# EAGLE design Arduino 1.0 (EAGLE 9.6.2)
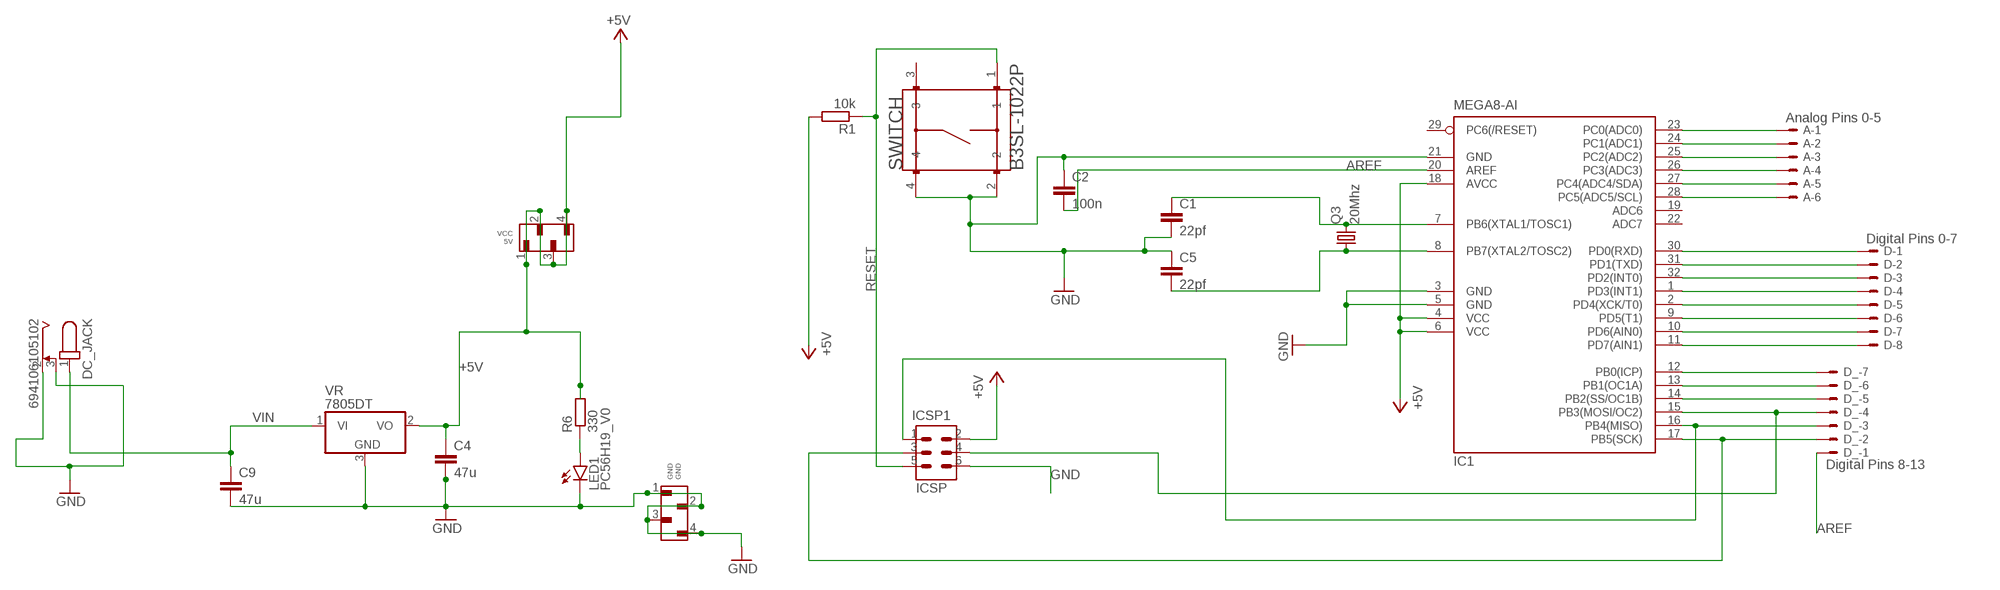
[diagram p0: schematic, sheet 1]

## Parts
A  Analog Pins 0-5  87438-06  [87438-06]
C1  22pf  C-EUC0805  [C0805]
C2  100n  C-EUC0805  [C0805]
C4  47u  C-EUC0805  [C0805]
C5  22pf  C-EUC0805  [C0805]
C9  47u  C-EUC0805  [C0805]
D  Digital Pins 0-7  87438-08  [87438-08]
D_  Digital Pins 8-13  87438-07  [87438-07]
DC_JACK  694106105102  [694106105102]
GND  GND  6100XX18221_61000418221  [61000418221]
IC1  MEGA8-AI  [TQFP32-08]
ICSP1  ICSP  621006245821  [621006245821]
LED1  PC56H19_V0  [PC56H19_V0]
Q3  20Mhz  FC-12M  [FC-12M]
R1  10k  R-EU_M0805  [M0805]
R6  330  R-EU_M0805  [M0805]
SWITCH  B3SL-1022P  [SW_B3SL-1022P]
VCC  5V  6100XX18221_61000418221  [61000418221]
VR  7805DT  [TO252]

## Nets
+5V [power]: C4.1 IC1.4(VCC) IC1.6(VCC) IC1.18(AVCC) ICSP1.2 R1.2 R6.2 VCC.1 VCC.2 VCC.3 VCC.4 VR.2(VO)
AREF [power]: C2.2 D_.1 IC1.20(AREF)
GND [power]: C1.2 C2.1 C4.2 C5.1 C9.2 DC_JACK.2 DC_JACK.3 GND.1 GND.2 GND.3 GND.4 IC1.3(GND) IC1.5(GND) IC1.21(GND) ICSP1.6 LED1.1(C) LED1.3(C) SWITCH.2 SWITCH.4 VR.3(GND)
N$1 [power]: C1.1 IC1.7(PB6(XTAL1/TOSC1)) Q3.2
N$2: D_.2 IC1.17(PB5(SCK)) ICSP1.3
N$3: LED1.2(A) LED1.4(A) R6.1
N$4: D_.3 IC1.16(PB4(MISO)) ICSP1.1
N$5 [power]: C5.2 IC1.8(PB7(XTAL2/TOSC2)) Q3.1
N$6: D_.5 IC1.14(PB2(SS/OC1B))
N$7: D_.6 IC1.13(PB1(OC1A))
N$8: D_.7 IC1.12(PB0(ICP))
N$9: D.1 IC1.30(PD0(RXD))
N$10: D.2 IC1.31(PD1(TXD))
N$11: D.3 IC1.32(PD2(INT0))
N$12: D.4 IC1.1(PD3(INT1))
N$13: D.5 IC1.2(PD4(XCK/T0))
N$14: D.6 IC1.9(PD5(T1))
N$15: D.7 IC1.10(PD6(AIN0))
N$16: D.8 IC1.11(PD7(AIN1))
N$17: A.1 IC1.23(PC0(ADC0))
N$18: A.2 IC1.24(PC1(ADC1))
N$19: A.3 IC1.25(PC2(ADC2))
N$20: A.4 IC1.26(PC3(ADC3))
N$21: A.5 IC1.27(PC4(ADC4/SDA))
N$22: A.6 IC1.28(PC5(ADC5/SCL))
N$29: D_.4 IC1.15(PB3(MOSI/OC2)) ICSP1.4
RESET: ICSP1.5 R1.1 SWITCH.1
VIN [power]: C9.1 DC_JACK.1 VR.1(VI)
Unconnected: IC1.19(ADC6) IC1.22(ADC7) IC1.29(PC6(/RESET)) SWITCH.3

## Library data of the parts
A = con-molex:87438-06: Wire-to-Board 1.50mm (.059") Pitch Header - Right Angle, SMT, Shrouded Source: http://www.molex.com/product/micro/87438.html; MF: MOLEX; MPN: 87438-0643; OC_FARNELL: 1756938; OC_NEWARK: 88K3155
C1 C2 C4 C5 C9 = rcl:C-EU: CAPACITOR, European symbol; SPICEPREFIX: C
D = con-molex:87438-08: Wire-to-Board 1.50mm (.059") Pitch Header - Right Angle, SMT, Shrouded Source: http://www.molex.com/product/micro/87438.html; MF: MOLEX; OC_FARNELL: 1756939; OC_NEWARK: unknown
D_ = con-molex:87438-07: Wire-to-Board 1.50mm (.059") Pitch Header - Right Angle, SMT, Shrouded Source: http://www.molex.com/product/micro/87438.html; MF: WALDOM/MOLEX; MPN: 87438-0733; OC_FARNELL: unknown; OC_NEWARK: 09J7507
DC_JACK = DC Power Jacks:694106105102: CONN PWR JACK 2.05X5.5MM SOLDER Manufacturer's datasheet <https://katalog.we-online.de/em/datasheet/6941xx105102.pdf>; CREATED_BY: PCBLayout.com; DIGIKEY_PART_NUMBER: 732-5928-2-ND; MANUFACTURER: Wurth Electronics Inc.; MPN: 694106105102
GND VCC = Wurth_Connectors_WR-PHD:6100XX18221_61000418221: WR-PHD 2.54 mm SMT Pin Header ARTICLE PROPERTIES: Pins:4;​ 6;​ 10;​ 14;​ 16;​ 24;​ 32;​ 34;​ 36 KIND PROPERTIES: Pitch：2.54 mm Quality Class:3 as per CECC 75 301-802 Rows：Single Gender：Pin Header Type：Straight Type 1;​ Straight Type 2 MATERIAL PROPERTIES: Insulator Material :PA6T Insulator Flammability Rating:UL94 V-0 Contact Material:Copper Alloy Contact Plating:Gold Contact Type:Stamped GENERAL INFORMATION Operating Temperature:-40 up to +125 °C Compliance:Lead free / RoHS ELECTRICAL PROPERTIES: Rated Current:3 A IR 1:3 A Withstanding Voltage:500 V (AC) Contact Resistance:20 mΩ RISO:1000 MΩ CERTIFICATION UL Approval:E323964 PACKAGING PROPERTIES Packaging:Tube <https://katalog.we-online.com/media/images/v2/o33202v209%20Family_WR-PHD_6100xx18221.jpg> Details see: https://katalog.we-online.com/en/em/PHD_2_54_SMT_PIN_HEADER_6100XX18X21 Updated by Yingchun,Shan 2019-10-18 2019 (C) Würth Elektronik; DATASHEET-URL: https://katalog.we-online.com/em/datasheet/61000418221.pdf; GENDER: Pin Header; IR: 3A; MATES: WR-PHD 2.54mm Angled Socket Header/SMT Socket Header/Socket Header/Socket Header Bottom Entry; PACKAGING: Tube; PART-NUMBER: 61000418221; PINS: 4; ROWS: Single; TYPE: Straight Type 1
IC1 = atmel:MEGA8: MICROCONTROLLER 8 Kbytes FLASH, 1 kbytes SRAM, 512 bytes EEPROM, USART, 6-channel 10 bit ADC, 2-channel 8 bit ADC Pin compatible with Atmega48, ATMega88, ATMega168 Source: avr.lbr; MPN: ATMEGA8-16AU; OC_FARNELL: 9171371; OC_NEWARK: 73M8863
ICSP1 = Headers:621006245821: 2.00mm SMT Straight Dual Low Profile Pin Header WR-PHD Manufacturer's datasheet <https://katalog.we-online.com/em/datasheet/621006245821.pdf>; CREATED_BY: PCBLayout.com; MANUFACTURER: Wurth Elektronik; MPN: 621006245821
LED1 = led:PC56H19_V0: Lextar white SMD LED Source: PC56H19_20150317.pdf www.lextar.com
Q3 = crystal:FC-12M: kHz RANGE CRYSTAL UNIT LOW PROFILE SMD Source: Epson Toyocom FC-12M.pdf
R1 R6 = rcl:R-EU_: RESISTOR, European symbol; SPICEPREFIX: R
SWITCH = B3SL-1022P:B3SL-1022P: Surface-mounting Switches with a Sealed Structure (Rubber Plunger), Crisp Feel, and Middle Stroke. Check prices <https://pricing.snapeda.com/parts/B3SL-1022P/Omron/view-part?ref=eda>; AVAILABILITY: In Stock; DESCRIPTION: Tactile Switch SPST-NO Top Actuated Surface Mount; MF: Omron; MP: B3SL-1022P; PACKAGE: None; PRICE: None; PURCHASE-URL: https://pricing.snapeda.com/search/part/B3SL-1022P/?ref=eda
VR = linear:78*: Positive VOLTAGE REGULATOR Source: http://cache.national.com/ds/LM/LM78L05.pdf http://www.fairchildsemi.com/ds/LM/LM7805.pdf

## Net classes
0 default: width 0.203 mm, clearance 0.203 mm
1 power: width 0.6 mm, clearance 0.305 mm

## Board
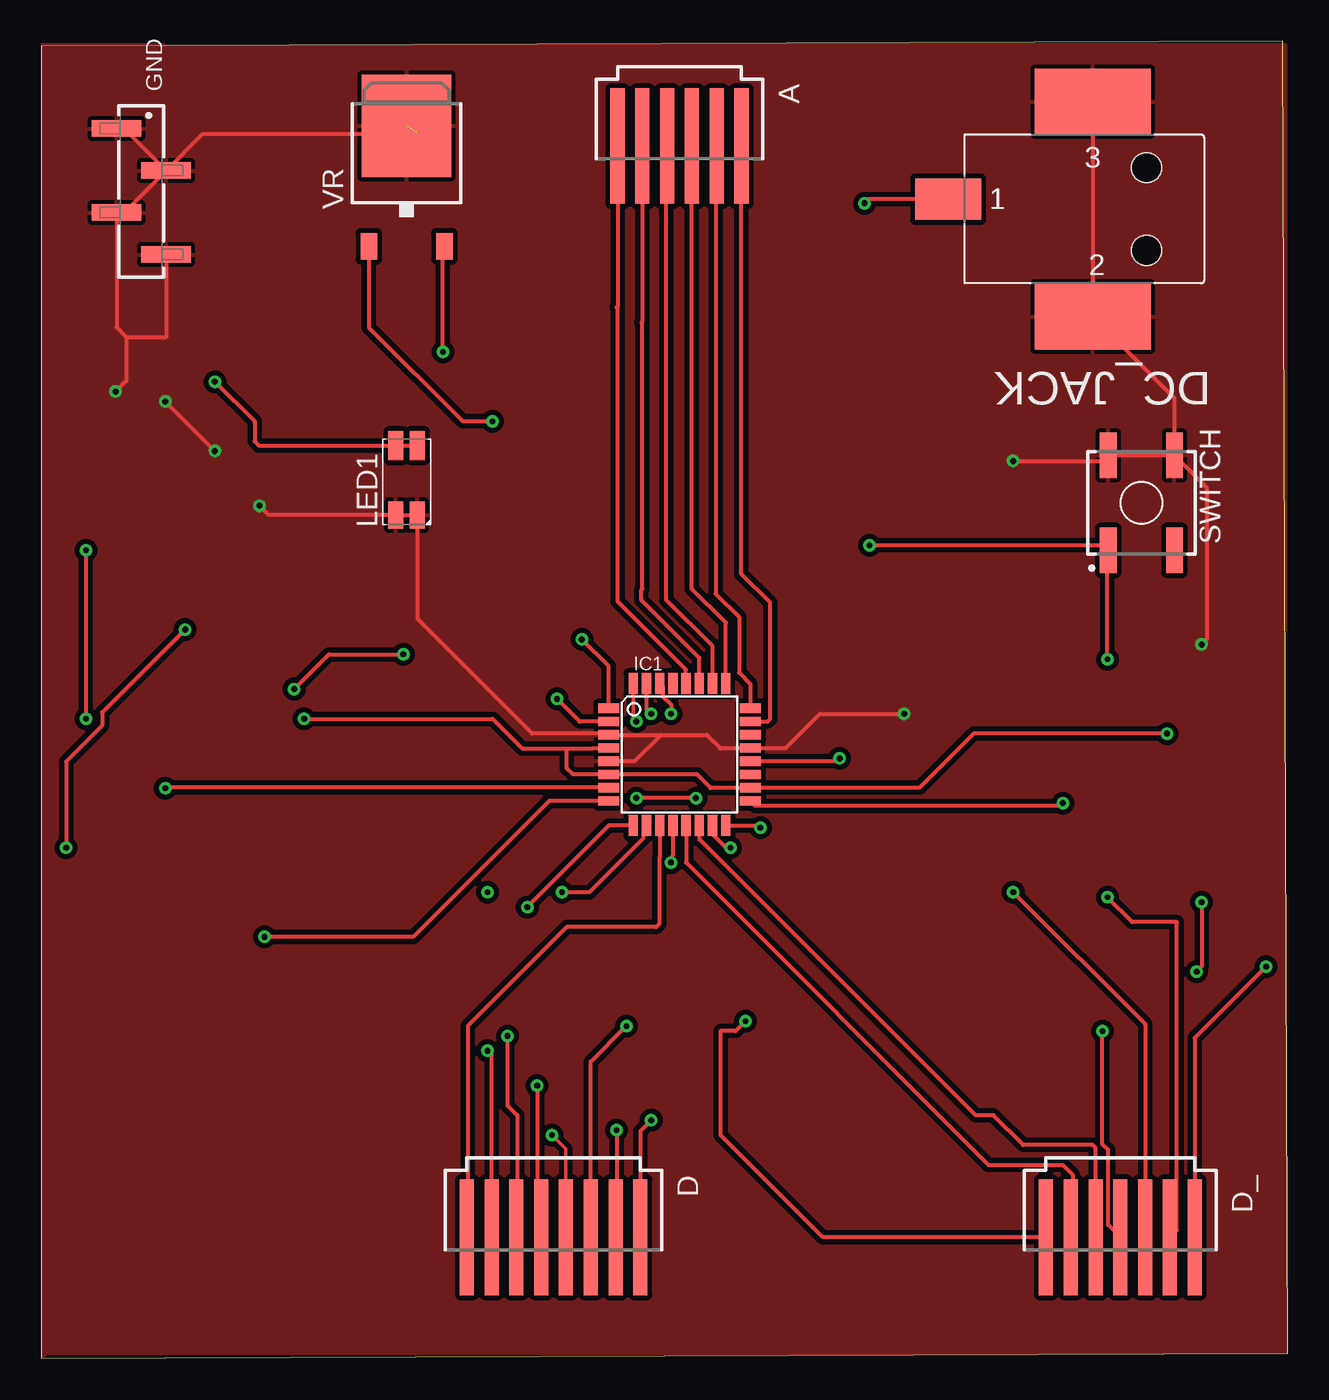
[diagram p1: board, top side]
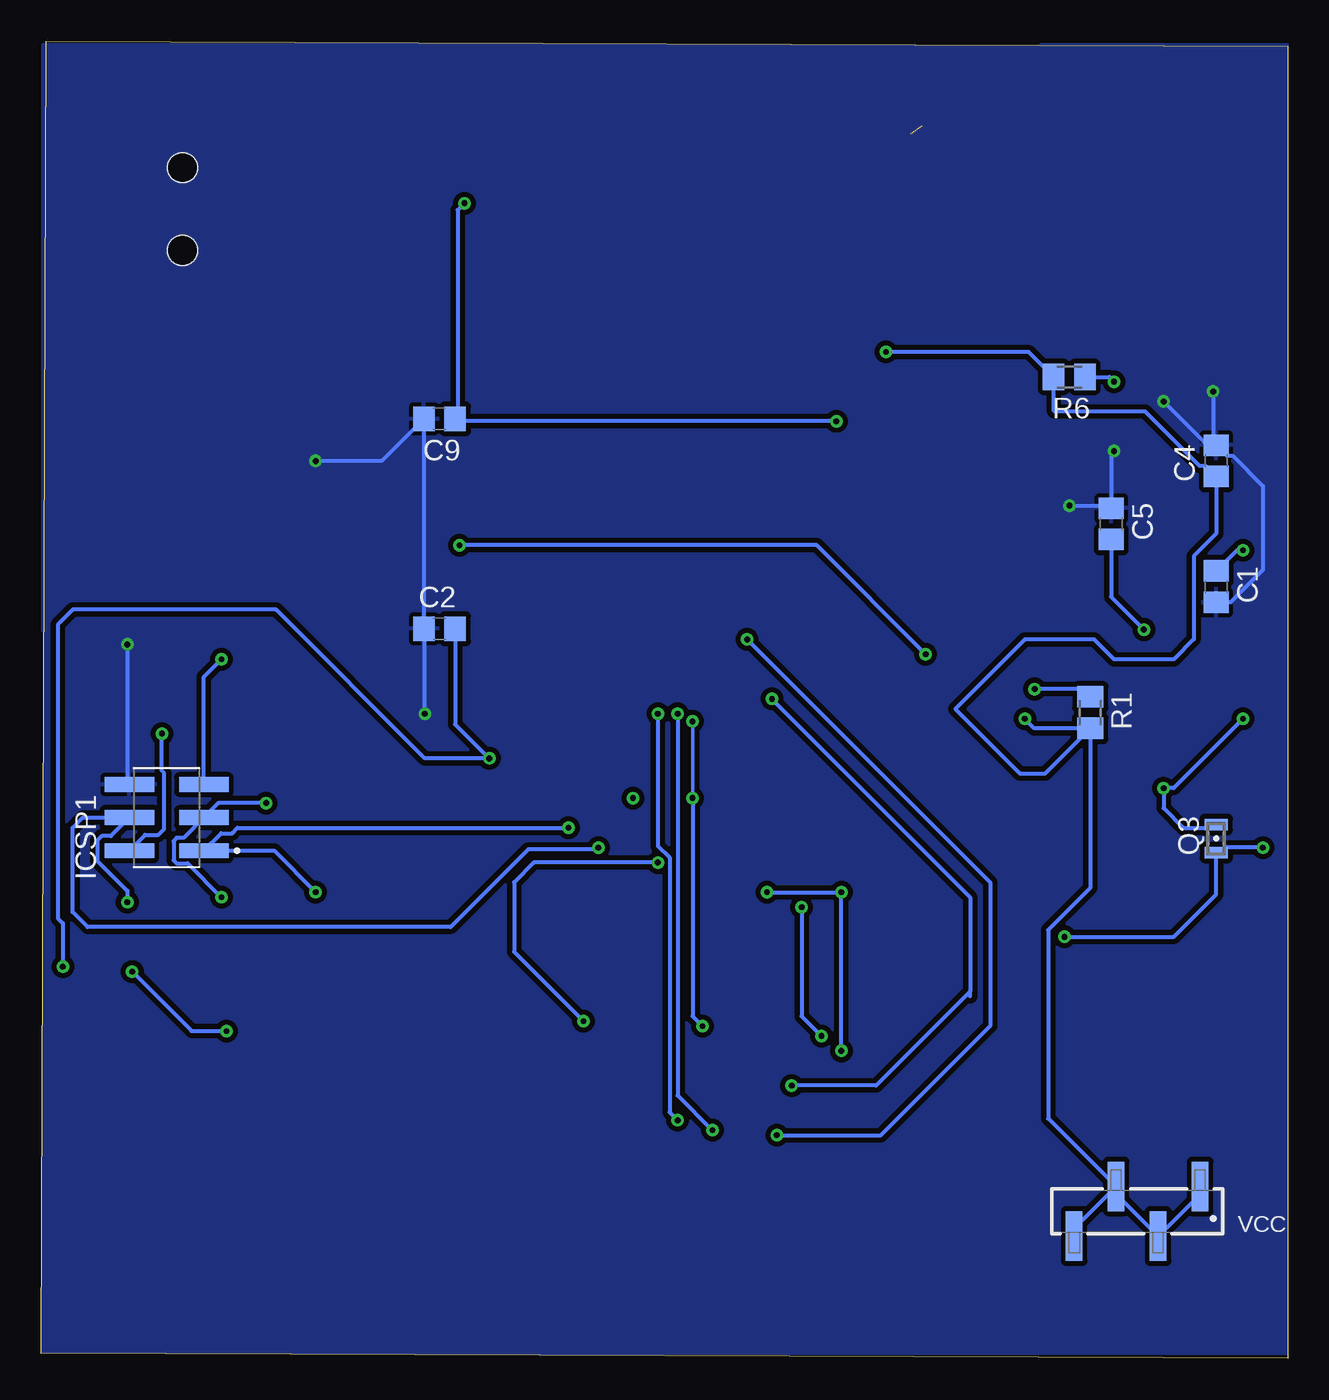
[diagram p2: board, bottom side, seen from below]

Size 75.4 x 79.7 mm. Coordinates in mm from the lower left corner, seen from the top.
Outline: 0,0 75.4,0.3 75.1,79.7 0,79.4 0,0
Copper layers (1*16): Top 0.035mm / dielectric 1.5mm / Bottom 0.035mm
Design rules "default *": minimum track width 1mil, minimum drill 0.35mm, track to track 1mil, track to pad 1mil, pad to pad 1mil, via to via 1mil, smd to smd 1mil, copper to edge 1mil, drill to drill 1mil, minimum pad ring 10mil, minimum via ring 8mil, stop-mask expansion 4mil, vias tented up to drill 0mil, thermal gap 10mil

### Footprints (pad centres in the part's own frame; a part is rotated, then mirrored left to right if it is on the bottom)
87438-06 = smd 7 x 0.85: 1 0,3.75; 2 0,2.25; 3 0,0.75; 4 0,-0.75; 5 0,-2.25; 6 0,-3.75
C0805 = smd 1.3 x 1.5: 1 -0.95,0; 2 0.95,0
87438-08 = smd 7 x 0.85: 1 0,5.25; 2 0,3.75; 3 0,2.25; 4 0,0.75; 5 0,-0.75; 6 0,-2.25; 7 0,-3.75; 8 0,-5.25
87438-07 = smd 7 x 0.85: 1 0,4.5; 2 0,3; 3 0,1.5; 4 0,0; 5 0,-1.5; 6 0,-3; 7 0,-4.5
694106105102 = smd 4 x 2.5: 1 15.5,-0.6 | smd 7 x 4: 2 6.75,6.5; 3 6.75,-6.5 | hole 1.8: 3.5,2.5; 3.5,-2.5
61000418221 = smd 1 x 3: 1 -3.81,-1.5; 2 -1.27,1.5; 3 1.27,-1.5; 4 3.81,1.5
TQFP32-08 = smd 1.27 x 0.559: 1 -4.293,2.8; 2 -4.293,2; 3 -4.293,1.2; 4 -4.293,0.4; 5 -4.293,-0.4; 6 -4.293,-1.2; 7 -4.293,-2; 8 -4.293,-2.8; 17 4.293,-2.8; 18 4.293,-2; 19 4.293,-1.2; 20 4.293,-0.4; 21 4.293,0.4; 22 4.293,1.2; 23 4.293,2; 24 4.293,2.8 | smd 0.559 x 1.27: 9 -2.8,-4.293; 10 -2,-4.293; 11 -1.2,-4.293; 12 -0.4,-4.293; 13 0.4,-4.293; 14 1.2,-4.293; 15 2,-4.293; 16 2.8,-4.293; 25 2.8,4.293; 26 2,4.293; 27 1.2,4.293; 28 0.4,4.293; 29 -0.4,4.293; 30 -1.2,4.293; 31 -2,4.293; 32 -2.8,4.293
621006245821 = smd 0.89 x 3: 1 -2,-2.25; 2 -2,2.25; 3 0,-2.25; 4 0,2.25; 5 2,-2.25; 6 2,2.25
PC56H19_V0 = smd 1.63 x 0.9: 1 -2.01,0.65; 3 -2.01,-0.645 | smd 1.73 x 0.9: 2 2.195,0.65; 4 2.195,-0.65
FC-12M = smd 0.7 x 1.4: 1 -0.85,0; 2 0.85,0
M0805 = smd 1.3 x 1.6: 1 -0.95,0; 2 0.95,0
SW_B3SL-1022P = smd 2.75 x 1: 1 2.875,-2; 2 -2.875,-2; 3 2.875,2; 4 -2.875,2
TO252 = smd 1 x 1.6: 1 -2.28,-4.8; 2 2.28,-4.8 | smd 5.4 x 6.2: 3 0,2.5

### Placement (x,y rotation side)
A  38.61,73.36 270 top
C1  4.32,46.69 270 bottom
C2  51.31,44.15 0 bottom
C4  4.32,54.31 90 bottom
C5  10.67,50.5 270 bottom
C9  51.31,56.85 180 bottom
D  30.99,7.32 270 top
D_  65.28,7.32 270 top
DC_JACK  70.36,69.55 180 top
GND  6.05,70.61 270 top
IC1  38.61,36.53 0 top
ICSP1  67.82,32.72 90 bottom
LED1  22.1,53.04 90 top
Q3  4.32,31.45 90 bottom
R1  11.94,39.07 270 bottom
R6  13.21,59.39 180 bottom
SWITCH  66.55,51.77 270 top
VCC  9.1,8.89 180 bottom
VR  22.1,72.09 0 top

### Tracks (layer width: path | path; a pad name or v marks a point on that pad's centre or on a via)
+5V  (via drill 0.35)
  Top 0.254: v15.9,38.7 27.3,38.7 29.1,36.9 31.8,36.9 | 31.8,36.9 33.32,36.9 | 33.32,36.9 33.35,36.93 | IC1.4 34.29,36.9 33.32,36.9 | v24.3,60.9 24.3,67.21 VR.2 | 31.8,36.9 31.8,35.7 32.17,35.33 IC1.6 39.67,35.33 40.5,34.5 42.87,34.5 IC1.18 53.13,34.53 56.4,37.8 v68.1,37.8
  Bottom 0.254: R1.2 11.94,28.45 14.48,25.91 14.48,14.5 VCC.3 | VCC.1 5.29,9.93 VCC.2 10.37,9.93 VCC.3 | VCC.3 12.91,7.85 VCC.4 | R1.2 14.66,35.4 16.2,35.4 20.1,39.3 15.9,43.5 11.7,43.5 10.5,42.3 6.9,42.3 5.67,43.52 5.67,48.54 4.32,49.9 C4.1 4.96,54.01 5.32,54.01 8.62,57.3 14.1,57.3 14.16,57.36 R6.2 15.67,60.9 v24.3,60.9 | R1.2 15.32,38.12 v15.9,38.7 | ICSP1.2 69.12,31.67 68.32,31.67 67.97,32.02 67.97,35.42 68.1,35.55 v68.1,37.8
AREF  (via drill 0.35)
  Top 0.254: IC1.20 48.13,36.13 v48.3,36.3 | v74.1,23.7 69.78,19.38 D_.1
  Bottom 0.254: C2.2 50.36,38.36 v48.3,36.3 52.2,36.3 61.2,45.3 73.5,45.3 74.41,44.4 74.41,26.62 74.1,26.32 v74.1,23.7
GND  (via drill 0.35)  (1 unrouted)
  Top 0.254: 37.5,37.73 IC1.3 34.24,37.8 29.7,37.8 22.75,44.76 LED1.3 LED1.1 13.77,51.03 v13.2,51.6 | 37.5,37.73 40.27,37.73 41.1,36.9 42.87,36.9 IC1.21 45.03,36.93 47.1,39 v52.2,39 | IC1.5 35.9,36.13 37.5,37.73 | GND.4 7.55,61.8 5.15,61.8 | 5.15,61.8 5.15,59.15 v4.5,58.5 | v7.5,57.9 v10.5,54.9 | v58.8,54.3 64.2,54.3 SWITCH.2 SWITCH.4 | DC_JACK.3 DC_JACK.2 68.55,58.11 SWITCH.4 | SWITCH.4 70.5,52.7 70.5,43.5 v70.2,43.2 | 5.15,61.8 4.55,62.4 GND.3 5.01,69.34 GND.2 | GND.2 5.01,74.42 GND.1 | GND.2 9.77,74.1 22.8,74.1 | VR.3
  Bottom 0.254: C4.2 3.67,54.62 3.32,54.62 1.5,52.8 1.5,47.7 3.46,45.74 C1.2 | v4.5,58.5 4.5,55.44 C4.2 | C4.2 4.86,55.26 v7.5,57.9 | v10.5,54.9 10.67,54.73 10.67,51.6 | 10.67,51.6 C5.1 | v58.8,54.3 54.81,54.3 C9.2 C2.1 52.2,44.09 v52.2,39 | v70.2,43.2 70.2,34.85 ICSP1.6 | v13.2,51.6 10.67,51.6
  pour Top: 0,79.5 75.3,79.5 75.3,0.3 0.3,0.3 0,0
  pour Bottom: 0,79.5 75.3,79.5 75.3,0.3 0,0.3
N$1  (via drill 0.35)
  Top 0.254: IC1.7 7.53,34.53 v7.5,34.5 | v2.7,48.9 v2.7,38.7
  Bottom 0.254: Q3.2 4.52,32.1 6.3,32.1 7.5,33.3 v7.5,34.5 6.9,34.5 v2.7,38.7 | C1.1 3.06,48.9 v2.7,48.9
N$2  (via drill 0.35)
  Top 0.254: v61.8,33.6 61.63,33.43 43.2,33.43 IC1.17 | D_.2 68.7,7.74 68.7,26.4 66,26.4 v64.5,27.9
  Bottom 0.254: v61.8,33.6 64.69,33.6 ICSP1.3 66.8,31.5 67.21,31.5 67.4,31.3 67.4,30.14 67.21,29.95 66.55,29.95 v64.5,27.9
N$3  (via drill 0.35)
  Top 0.254: v10.5,59.1 12.9,56.7 12.9,55.5 13.16,55.23 LED1.2 LED1.4
  Bottom 0.254: R6.1 10.79,59.39 v10.5,59.1
N$4  (via drill 0.35)
  Top 0.254: IC1.16 43.36,32.24 v43.5,32.1 | v58.8,28.2 66.78,20.22 D_.3
  Bottom 0.254: v43.5,32.1 63.53,32.1 63.86,31.77 64.52,31.77 ICSP1.1 61.32,30.72 v58.8,28.2
N$5  (via drill 0.35)
  Top 0.254: IC1.8 30.73,33.73 22.5,25.5 v13.5,25.5 | v8.7,44.1 3.68,39.08 3.68,38.29 1.5,36.11 v1.5,30.9
  Bottom 0.254: v13.5,25.5 6.9,25.5 4.32,28.08 4.32,30.3 | 4.32,30.3 Q3.1 | C5.2 10.67,46.07 v8.7,44.1 | v1.5,30.9 3.72,30.9 4.32,30.3
N$6
  Top 0.254: D_.5 63.78,12.72 63.6,12.9 59.4,12.9 57.6,14.7 56.52,14.7 39.83,31.39 39.83,32.22 IC1.14
N$7
  Top 0.254: IC1.13 39.01,29.99 57.3,11.7 61.8,11.7 62.4,11.1 62.4,7.44 D_.6
N$8  (via drill 0.35)
  Top 0.254: 38.23,32.22 IC1.12 38.21,30.41 38.1,30.3 v38.1,30 | D_.7 47.28,7.32 41.1,13.5 41.1,19.8 42,19.8 v42.6,20.4
  Bottom 0.254: v38.1,30 45.6,30 46.8,28.8 46.8,24.6 v42.6,20.4
N$9  (via drill 0.35)
  Top 0.254: IC1.30 37.6,40.63 37.6,40.05 38.1,39.55 v38.1,39 | v36.9,14.4 36.24,13.74 D.1
  Bottom 0.254: v38.1,39 38.1,31 37.39,30.29 37.39,14.89 v36.9,14.4
N$10  (via drill 0.35)
  Top 0.254: IC1.31 36.61,39.29 v36.9,39 | v34.8,13.8 34.8,9 34.74,8.94 D.2
  Bottom 0.254: v36.9,39 36.9,15.9 v34.8,13.8
N$11  (via drill 0.35)
  Top 0.203: IC1.32 35.81,38.73 v36,38.54
  Top 0.254: v39.6,33.9 v36,33.9 | D.3 33.24,17.94 v35.4,20.1
  Bottom 0.203: v36,38.54 v36,33.9
  Bottom 0.254: v36,33.9 36,20.7 v35.4,20.1
N$12  (via drill 0.35)
  Top 0.203: D.4 31.74,12.66 v30.9,13.5
  Top 0.254: IC1.1 34.32,41.88 v32.7,43.5
  Bottom 0.254: v32.7,43.5 18,28.8 18,20.1 24.6,13.5 v30.9,13.5
N$13  (via drill 0.35)
  Top 0.254: IC1.2 32.57,38.53 v31.2,39.9 | v30,16.5 30,6 30.3,6 30.3,7.26 D.5
  Bottom 0.254: v31.2,39.9 19.2,27.9 19.2,22.2 | 19.2,21.9 19.2,22.2 | 19.2,22.2 24.9,16.5 v30,16.5
N$14  (via drill 0.35)
  Top 0.254: IC1.9 34.34,32.24 v29.4,27.3 | v28.2,19.5 28.2,15.3 28.8,14.7 28.8,7.38 D.6
  Bottom 0.254: v29.4,27.3 29.4,20.7 v28.2,19.5
N$15  (via drill 0.35)
  Top 0.254: IC1.10 36.42,32.05 36.42,31.47 33.15,28.2 v31.5,28.2 | D.7 27.24,18.36 v27,18.6
  Bottom 0.254: v27,18.6 v27,28.2 v31.5,28.2
N$16
  Top 0.254: IC1.11 37.41,30.31 37.39,30.29 37.39,26.29 37.2,26.1 31.8,26.1 25.8,20.1 25.8,7.38 D.8
N$17
  Top 0.254: IC1.23 43.93,38.53 44.1,38.7 44.1,45.72 42.36,47.46 A.1
N$18
  Top 0.254: A.2 40.8,73.3 40.8,46.26 42.21,44.84 42.21,41.49 42.9,40.8 IC1.24
N$19
  Top 0.254: A.3 39.36,46.56 41.41,44.51 IC1.25
N$20
  Top 0.254: IC1.26 40.61,43.09 37.8,45.9 37.8,73.3 A.4
N$21
  Top 0.254: A.5 36.36,62.76 | 36.36,62.76 36.3,62.7 | IC1.27 39.81,42.39 36.3,45.9 36.3,46.5 36.36,46.56 36.36,62.76
N$22
  Top 0.254: A.6 34.86,63.66 | 34.8,63.6 34.86,63.66 | IC1.28 38.99,40.84 38.99,41.67 34.86,45.8 34.86,63.66
N$29  (via drill 0.35)
  Top 0.254: IC1.15 40.61,31.69 41.4,30.9 v41.7,30.9 | D_.4 64.53,8.06 64.53,12.61 64.2,12.95 v64.2,19.8 | v70.2,27.6 70.2,23.7 v69.9,23.4
  Bottom 0.254: 72.28,32.72 ICSP1.4 71.19,31.6 71.75,31.6 72,31.34 72,30.1 70.2,28.29 v70.2,27.6 | 72.28,32.72 72.3,32.7 | v41.7,30.9 41.8,30.8 45.93,30.8 50.64,26.1 72.6,26.1 73.5,27 73.5,32.1 72.88,32.72 72.28,32.72 | v69.9,23.4 66.3,19.8 v64.2,19.8
RESET  (via drill 0.35)
  Top 0.254: v15.3,40.5 17.4,42.6 v21.9,42.6 | v50.1,49.2 64.25,49.2 SWITCH.1 64.5,48.84 v64.5,42.3
  Bottom 0.254: R1.1 12.42,40.5 v15.3,40.5 | v21.9,42.6 28.5,49.2 v50.1,49.2 | ICSP1.5 65.57,41.23 v64.5,42.3
VIN  (via drill 0.35)
  Top 0.254: VR.1 19.82,62.38 25.5,56.7 v27.3,56.7 | DC_JACK.1 50.05,70.15 v49.8,69.9
  Bottom 0.254: v27.3,56.7 50.21,56.7 | 50.21,56.7 C9.1 | v49.8,69.9 50.21,69.49 50.21,56.7